# EAGLE design ctrl_dog (EAGLE 5.10)
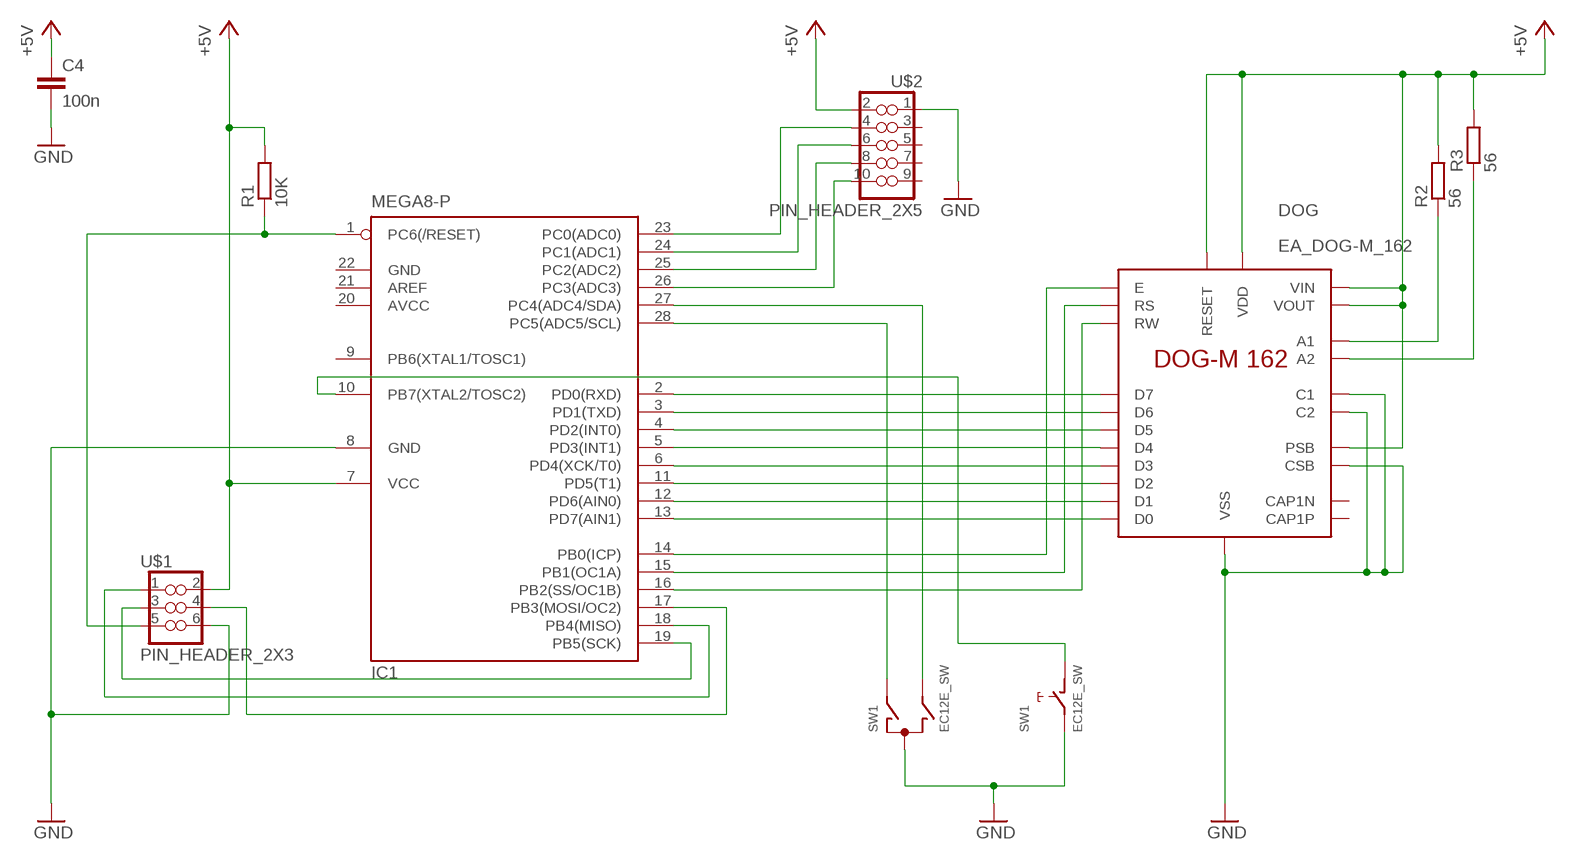
[diagram p0: schematic, sheet 1]

## Parts
C4  100n  C-EUC0805  [C0805]
DOG  EA_DOG-M_162  [EA_DOG-M]
IC1  MEGA8-P  [DIL28-3]
R1  10K  R-EU_M1206  [M1206]
R2  56  R-EU_R1206  [R1206]
R3  56  R-EU_R1206  [R1206]
SW1  EC12E_SW  [ALPS_EC12E_SW]
U$1  PIN_HEADER_2X3  [PINH_2X3_SMD]
U$2  PIN_HEADER_2X5  [PINH_2X5_SMD]

## Nets
+5V: C4.1 DOG.23(PSB) DOG.24(VOUT) DOG.25(VIN) DOG.26(VDD) DOG.40(RESET) IC1.7(VCC) R1.2 R2.2 R3.2 U$1.2 U$2.2
GND: C4.2 DOG.2(C1) DOG.19(C2) DOG.27(VSS) DOG.38(CSB) IC1.8(GND) SW1.C SW1.E U$1.6 U$2.1
N$1: DOG.1(A1) R2.1
N$3: DOG.20(A2) R3.1
N$4: IC1.23(PC0(ADC0)) U$2.4
N$5: DOG.29(D6) IC1.3(PD1(TXD))
N$6: DOG.30(D5) IC1.4(PD2(INT0))
N$7: DOG.31(D4) IC1.5(PD3(INT1))
N$8: DOG.32(D3) IC1.6(PD4(XCK/T0))
N$9: DOG.33(D2) IC1.11(PD5(T1))
N$10: DOG.34(D1) IC1.12(PD6(AIN0))
N$11: DOG.35(D0) IC1.13(PD7(AIN1))
N$13: IC1.1(PC6(/RESET)) R1.1 U$1.5
N$14: DOG.37(RW) IC1.16(PB2(SS/OC1B))
N$15: DOG.39(RS) IC1.15(PB1(OC1A))
N$16: IC1.24(PC1(ADC1)) U$2.6
N$17: IC1.25(PC2(ADC2)) U$2.8
N$18: IC1.17(PB3(MOSI/OC2)) U$1.4
N$19: IC1.18(PB4(MISO)) U$1.1
N$20: IC1.19(PB5(SCK)) U$1.3
N$21: DOG.36(E) IC1.14(PB0(ICP))
N$22: IC1.26(PC3(ADC3)) U$2.10
N$23: IC1.28(PC5(ADC5/SCL)) SW1.A
N$24: IC1.27(PC4(ADC4/SDA)) SW1.B
N$25: IC1.10(PB7(XTAL2/TOSC2)) SW1.D
N$26: DOG.28(D7) IC1.2(PD0(RXD))
Unconnected: DOG.21(CAP1N) DOG.22(CAP1P) IC1.9(PB6(XTAL1/TOSC1)) IC1.21(AREF) SW1.GND1(G) SW1.GND2(G) U$2.3 U$2.5 U$2.7 U$2.9

## Power pins joined to a net without a drawn wire
AVCC: IC1.20(AVCC)
GND: IC1.22(GND)

## Library data of the parts
C4 = rcl:C-EU: CAPACITOR, European symbol
DOG = midi:EA_DOG-M_162
IC1 = atmel:MEGA8-P: MICROCONTROLLER 8 Kbytes FLASH, 1 kbytes SRAM, 512 bytes EEPROM, USART, 4-channel 10 bit ADC, 2-channel 8 bit ADC Pin compatible with Atmega48, ATMega88, ATMega168 Source: avr.lbr
R1-R3 = rcl:R-EU_: RESISTOR, European symbol
SW1 = switch-alps:EC12E_SW: ALPS rotary Encoder EC12E series with switch
U$1 = midi:PIN_HEADER_2X3
U$2 = midi:PIN_HEADER_2X5

## Board
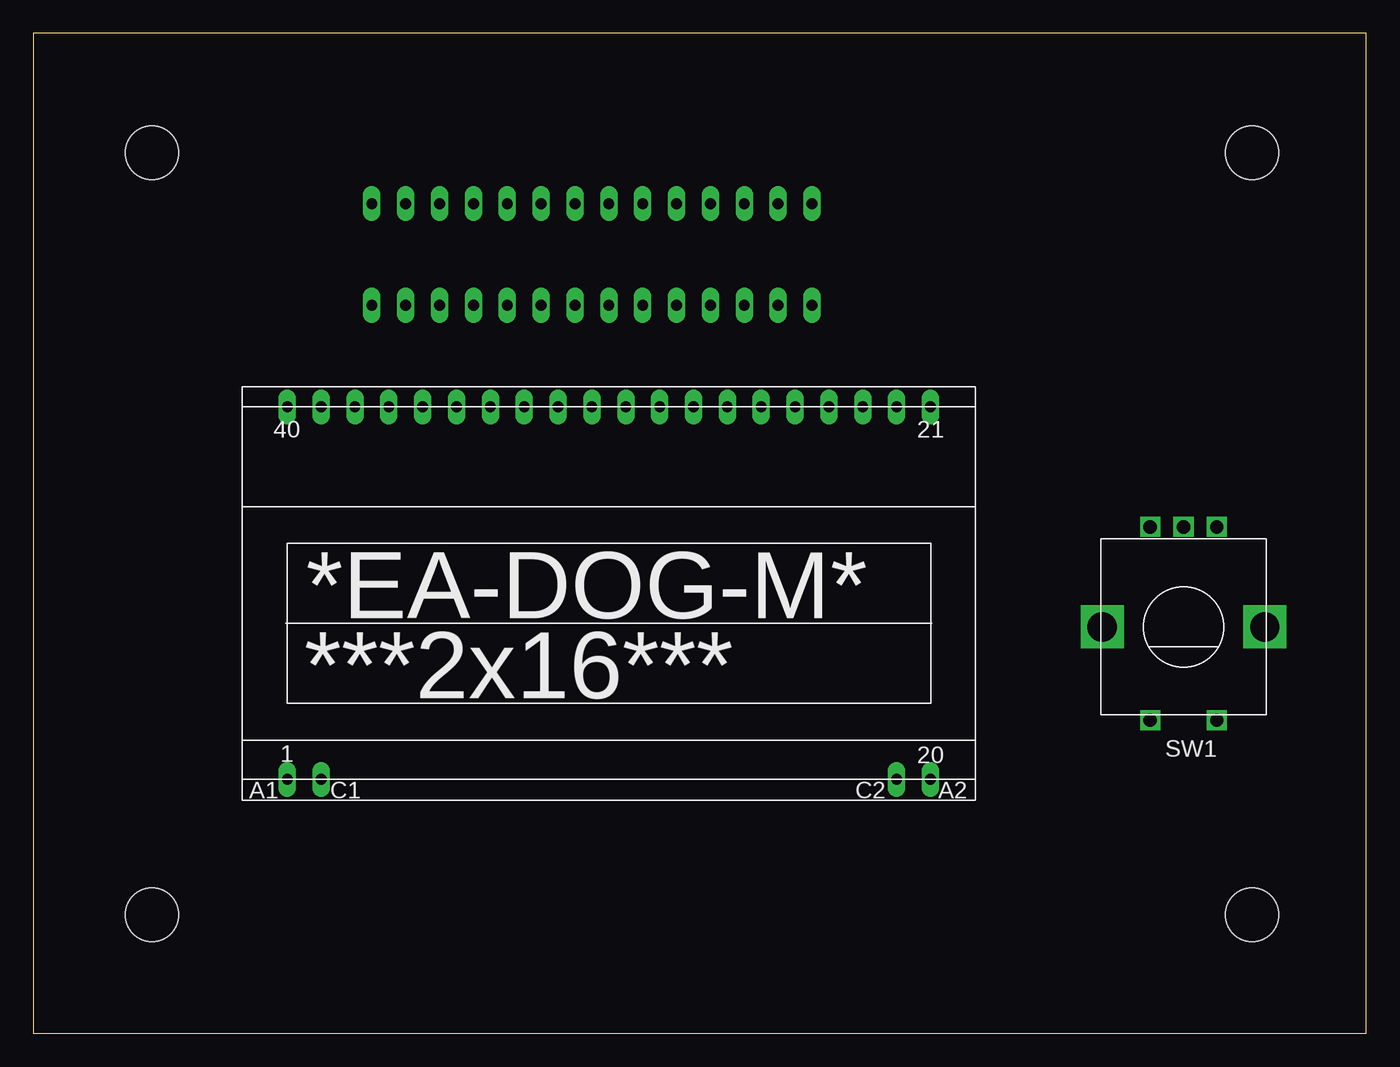
[diagram p1: board, top side]
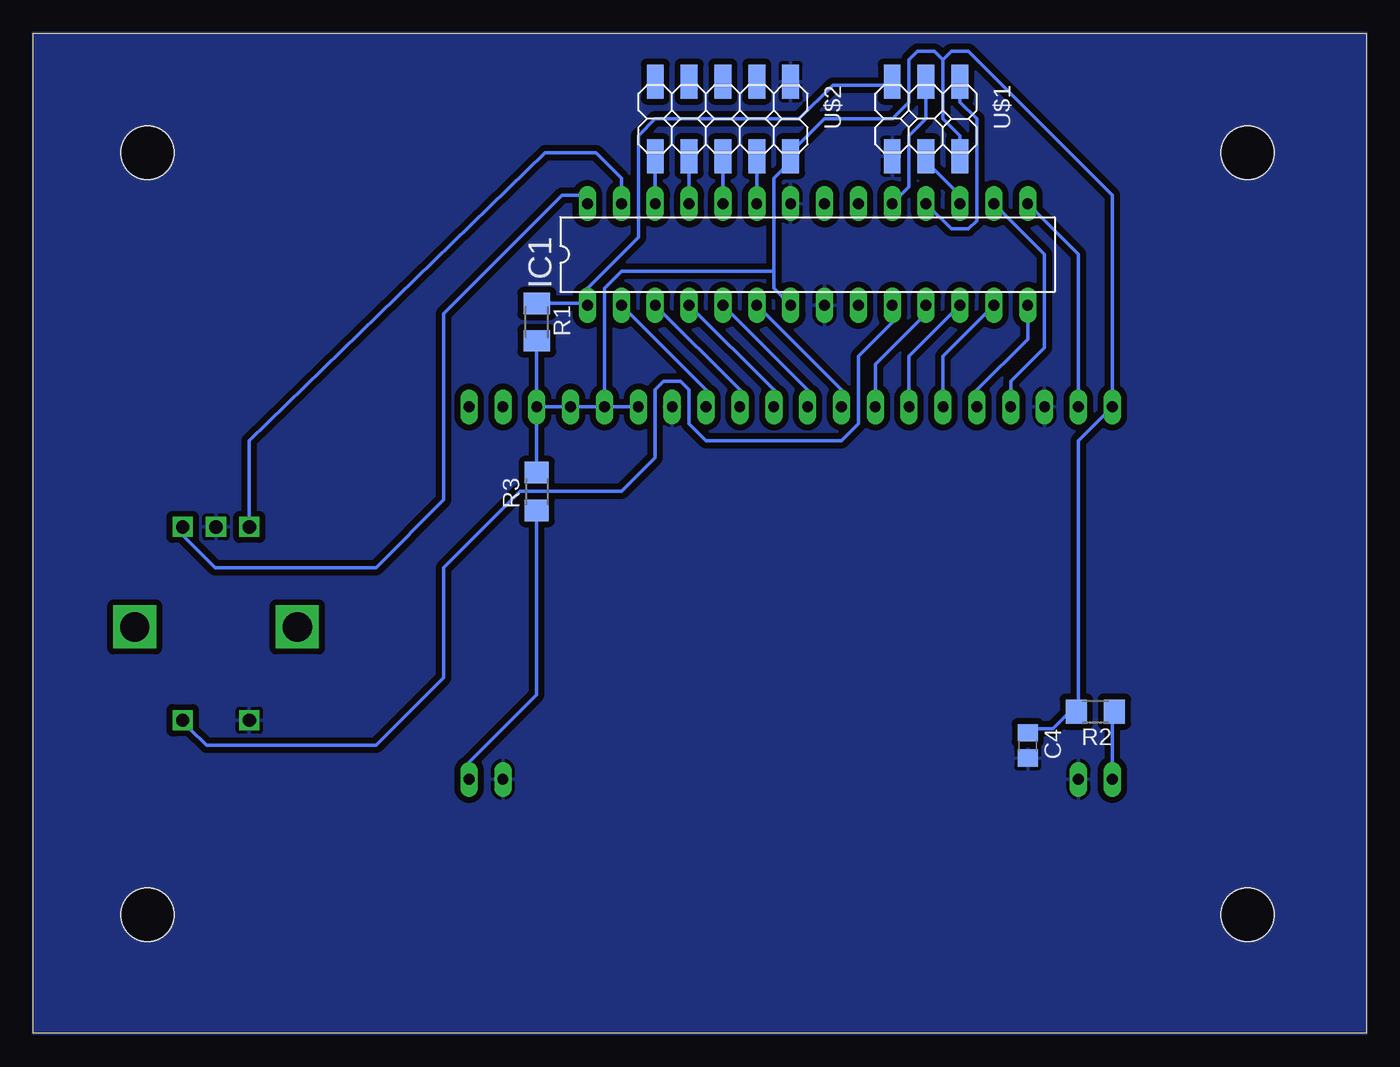
[diagram p2: board, bottom side, seen from below]

Size 100 x 75 mm. Coordinates in mm from the lower left corner, seen from the top.
Outline: 0,0 100,0 100,75 0,75 0,0
Copper layers (1*16): Top 0.035mm / dielectric 1.5mm / Bottom 0.035mm
Design rules "default *": minimum track width 10mil, minimum drill 24mil, track to track 18mil, track to pad 18mil, pad to pad 19mil, via to via 19mil, smd to smd 10mil, copper to edge 0mil, drill to drill 8mil, minimum pad ring 10mil, minimum via ring 8mil, stop-mask expansion 4mil, vias tented up to drill 0mil, thermal gap 10mil
Holes 4 mm at 91.44,8.89 91.44,66.04 8.89,66.04 8.89,8.89

### Footprints (pad centres in the part's own frame; a part is rotated, then mirrored left to right if it is on the bottom)
C0805 = smd 1.3 x 1.5: 1 -0.95,0; 2 0.95,0
EA_DOG-M = drill 0.8 long: 1 -24.13,-13.97; 2 -21.59,-13.97; 19 21.59,-13.97; 20 24.13,-13.97; 21 24.13,13.97; 22 21.59,13.97; 23 19.05,13.97; 24 16.51,13.97; 25 13.97,13.97; 26 11.43,13.97; 27 8.89,13.97; 28 6.35,13.97; 29 3.81,13.97; 30 1.27,13.97; 31 -1.27,13.97; 32 -3.81,13.97; 33 -6.35,13.97; 34 -8.89,13.97; 35 -11.43,13.97; 36 -13.97,13.97; 37 -16.51,13.97; 38 -19.05,13.97; 39 -21.59,13.97; 40 -24.13,13.97
DIL28-3 = drill 0.813 long: 1 -16.51,-3.81; 2 -13.97,-3.81; 3 -11.43,-3.81; 4 -8.89,-3.81; 5 -6.35,-3.81; 6 -3.81,-3.81; 7 -1.27,-3.81; 8 1.27,-3.81; 9 3.81,-3.81; 10 6.35,-3.81; 11 8.89,-3.81; 12 11.43,-3.81; 13 13.97,-3.81; 14 16.51,-3.81; 15 16.51,3.81; 16 13.97,3.81; 17 11.43,3.81; 18 8.89,3.81; 19 6.35,3.81; 20 3.81,3.81; 21 1.27,3.81; 22 -1.27,3.81; 23 -3.81,3.81; 24 -6.35,3.81; 25 -8.89,3.81; 26 -11.43,3.81; 27 -13.97,3.81; 28 -16.51,3.81
M1206 = smd 1.6 x 2: 1 -1.4,0; 2 1.4,0
R1206 = smd 1.6 x 1.803: 1 -1.422,0; 2 1.422,0
ALPS_EC12E_SW = drill 1 square: A -2.5,-7.5; B 2.5,-7.5; C 0,-7.5; D -2.5,7; E 2.5,7 | drill 2.2 square: GND1 -6.1,0; GND2 6.1,0
PINH_2X3_SMD = smd 2.54 x 1.27: 1 -2.794,2.54; 2 2.794,2.54; 3 -2.794,0; 4 2.794,0; 5 -2.794,-2.54; 6 2.794,-2.54
PINH_2X5_SMD = smd 2.54 x 1.27: 1 -2.794,5.08; 2 2.794,5.08; 3 -2.794,2.54; 4 2.794,2.54; 5 -2.794,0; 6 2.794,0; 7 -2.794,-2.54; 8 2.794,-2.54; 9 -2.794,-5.08; 10 2.794,-5.08

### Placement (x,y rotation side)
C4  25.4,21.59 270 bottom
DOG  43.18,33.02 0 top
IC1  41.91,58.42 0 bottom
R1  62.23,53.34 270 bottom
R2  20.32,24.13 180 bottom
R3  62.23,40.64 90 bottom
SW1  86.3,30.48 180 top
U$1  33.02,68.58 270 bottom
U$2  48.26,68.58 270 bottom

### Tracks (layer width: path | path; a pad name or v marks a point on that pad's centre or on a via)
+5V
  Bottom 0.254: C4.1 25.4,22.86 23.5,22.86 22.23,24.13 R2.2 21.59,24.13 21.59,44.45 DOG.40 19.05,62.87 29.84,73.66 31.11,73.66 31.75,73.03 | 31.75,73.03 31.75,68.58 30.48,67.31 U$1.2 | 44.45,57.15 44.45,55.88 IC1.7 | 44.45,57.15 44.45,64.14 43.18,65.41 U$2.2 43.18,66.04 40.64,68.58 35.56,68.58 34.29,69.85 34.29,73.03 33.66,73.66 32.38,73.66 31.75,73.03 | DOG.25 DOG.26 | DOG.25 DOG.24 DOG.23 | 44.45,57.15 55.88,57.15 57.15,55.88 DOG.25 | DOG.23 R3.2 | DOG.23 R1.2
GND
  pour Bottom: 0,75 0,0 100,0 100,75
N$1
  Bottom 0.254: DOG.1 19.05,24.13 R2.1
N$3
  Bottom 0.254: R3.1 62.23,25.4 67.31,20.32 DOG.20
N$4
  Bottom 0.254: IC1.23 U$2.4
N$5
  Bottom 0.254: DOG.29 46.99,48.26 IC1.3
N$6
  Bottom 0.254: DOG.30 44.45,48.26 IC1.4
N$7
  Bottom 0.254: DOG.31 41.91,48.26 IC1.5
N$8
  Bottom 0.254: DOG.32 39.37,48.26 IC1.6
N$9
  Bottom 0.254: DOG.33 36.83,50.16 33.02,53.98 IC1.11
N$10
  Bottom 0.254: DOG.34 34.29,50.8 IC1.12
N$11
  Bottom 0.254: DOG.35 31.75,50.8 IC1.13
N$13
  Bottom 0.254: U$1.5 35.56,71.12 40.01,71.12 42.55,68.58 53.34,68.58 54.61,67.31 54.61,59.69 58.42,55.88 IC1.1 58.55,54.74 R1.1
N$14
  Bottom 0.254: DOG.37 26.67,48.9 24.13,51.44 24.13,58.42 IC1.16
N$15
  Bottom 0.254: DOG.39 21.59,58.42 IC1.15
N$16
  Bottom 0.254: IC1.24 U$2.6
N$17
  Bottom 0.254: IC1.25 U$2.8
N$18
  Bottom 0.254: IC1.17 30.48,62.87 33.02,65.41 U$1.4
N$19
  Bottom 0.254: IC1.18 31.11,60.33 29.84,60.33 29.21,60.96 29.21,68.58 30.48,69.85 U$1.1
N$20
  Bottom 0.254: IC1.19 34.29,63.5 34.29,67.31 33.02,68.58 U$1.3
N$21
  Bottom 0.254: DOG.36 29.21,48.26 25.4,52.07 IC1.14
N$22
  Bottom 0.254: IC1.26 U$2.10
N$23
  Bottom 0.254: IC1.28 58.42,62.87 60.33,62.87 69.22,53.98 69.22,40.01 74.3,34.92 86.36,34.92 88.8,37.36 SW1.A
N$24
  Bottom 0.254: IC1.27 55.88,64.14 57.78,66.04 61.59,66.04 83.82,44.45 83.82,38.1 SW1.B
N$25
  Bottom 0.254: IC1.10 35.56,53.34 38.1,50.8 38.1,45.72 39.37,44.45 49.53,44.45 50.8,45.72 50.8,48.26 51.44,48.9 52.7,48.9 53.34,48.26 53.34,43.18 55.88,40.64 63.5,40.64 69.22,34.92 69.22,26.67 74.3,21.59 87,21.59 88.27,22.86 SW1.D 89.34,22.86
N$26
  Bottom 0.254: DOG.28 49.53,48.26 IC1.2